# EasyEDA Pro project test Project_2026-04-05_21-01-09.eprj, board PCB1
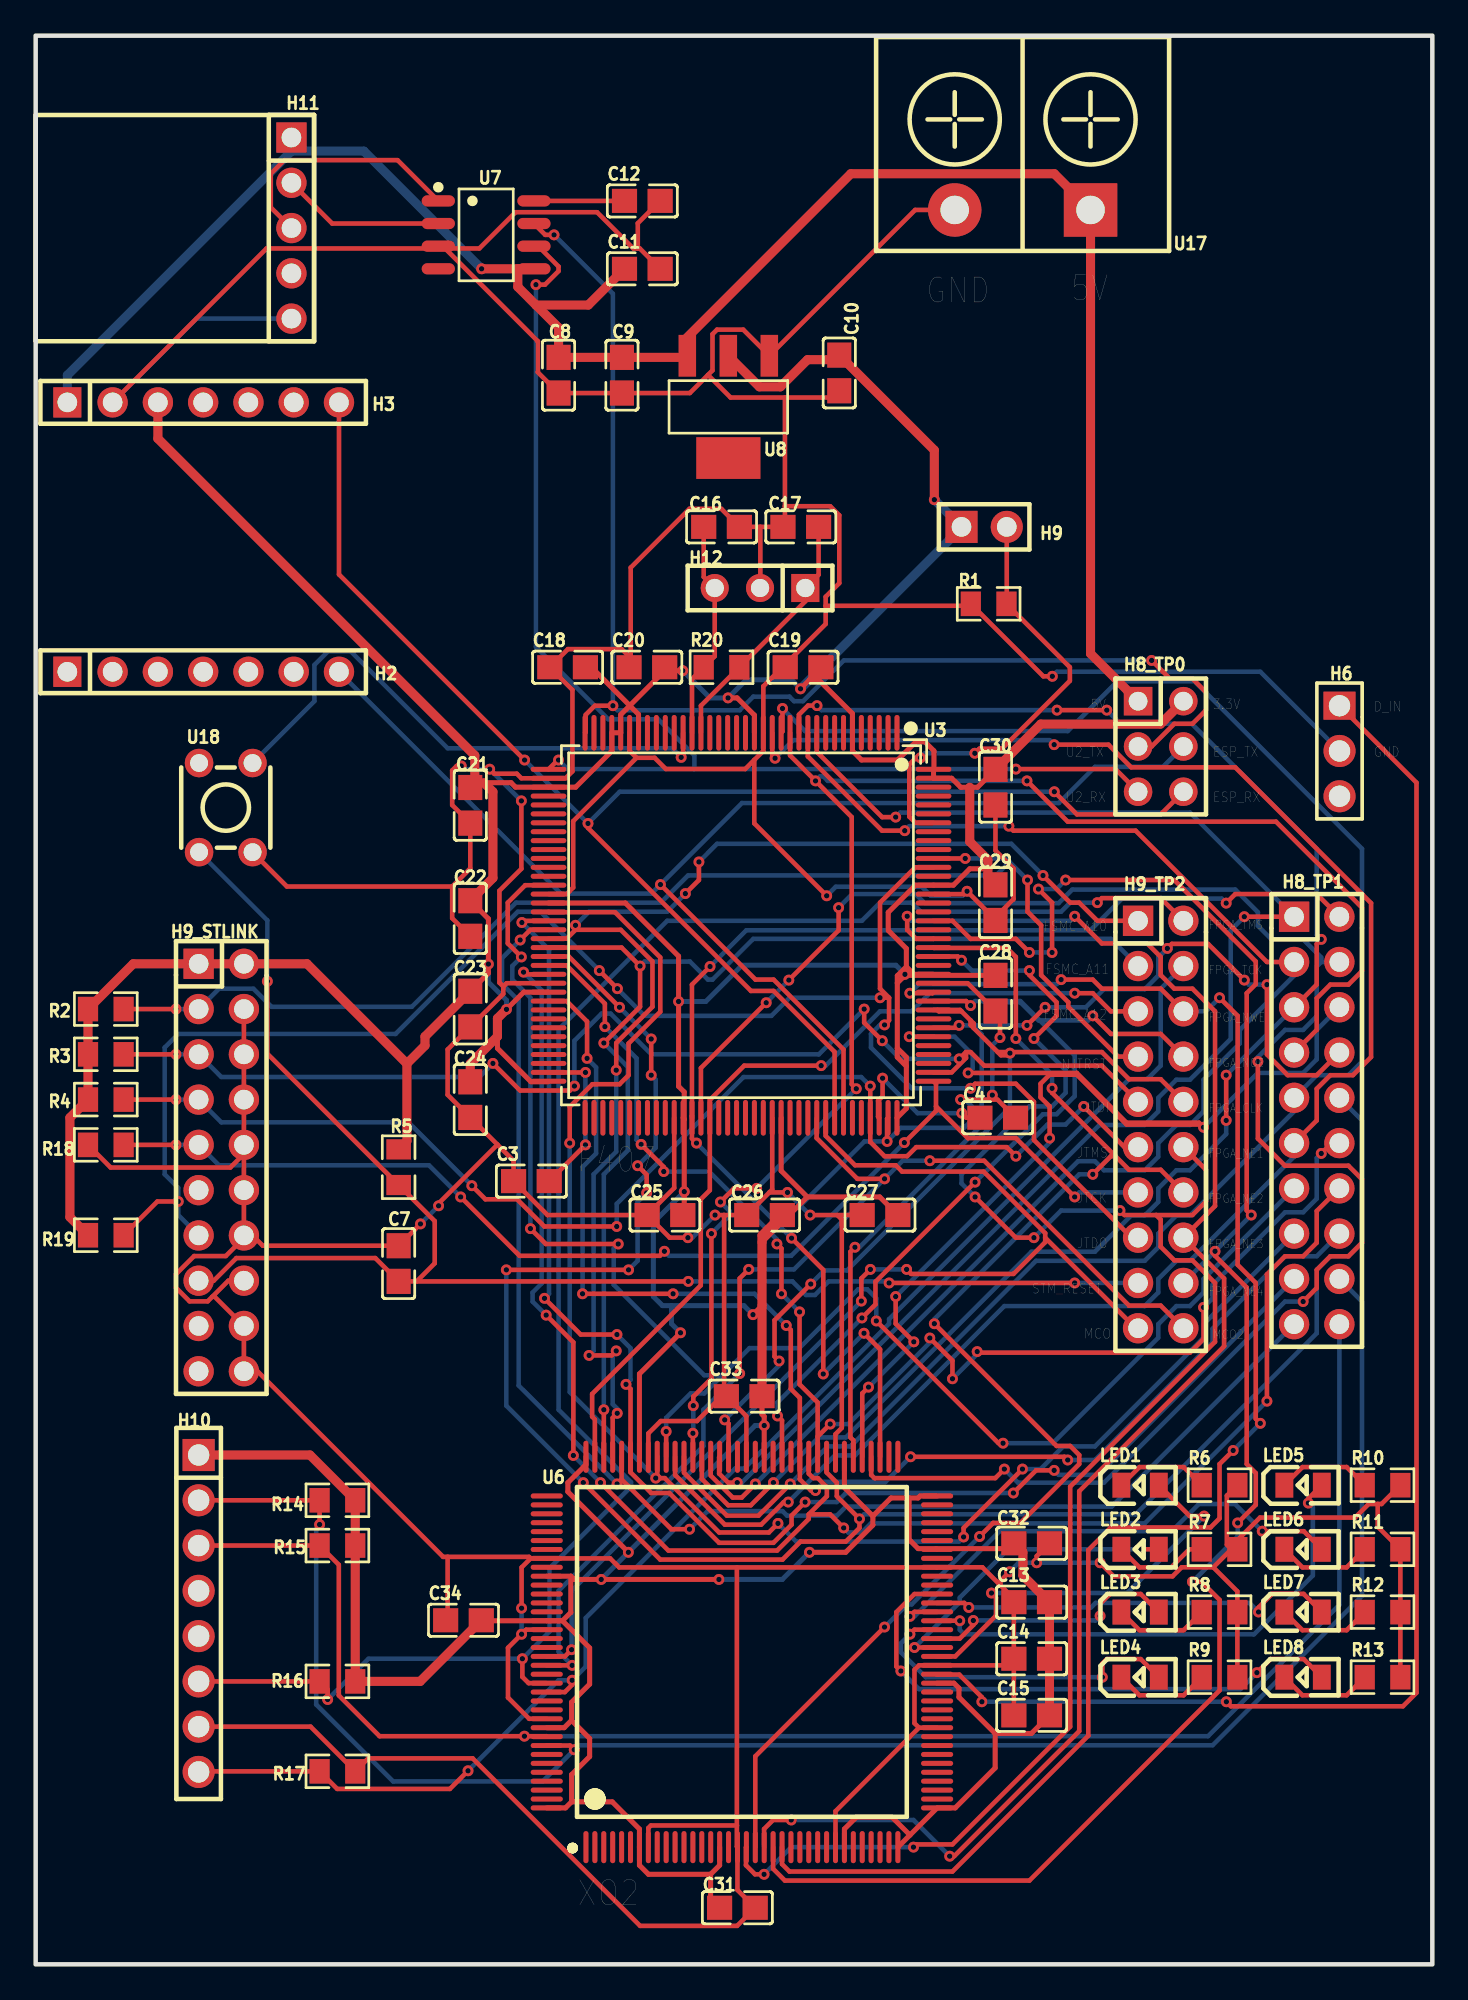
[diagram p1: board, top side]
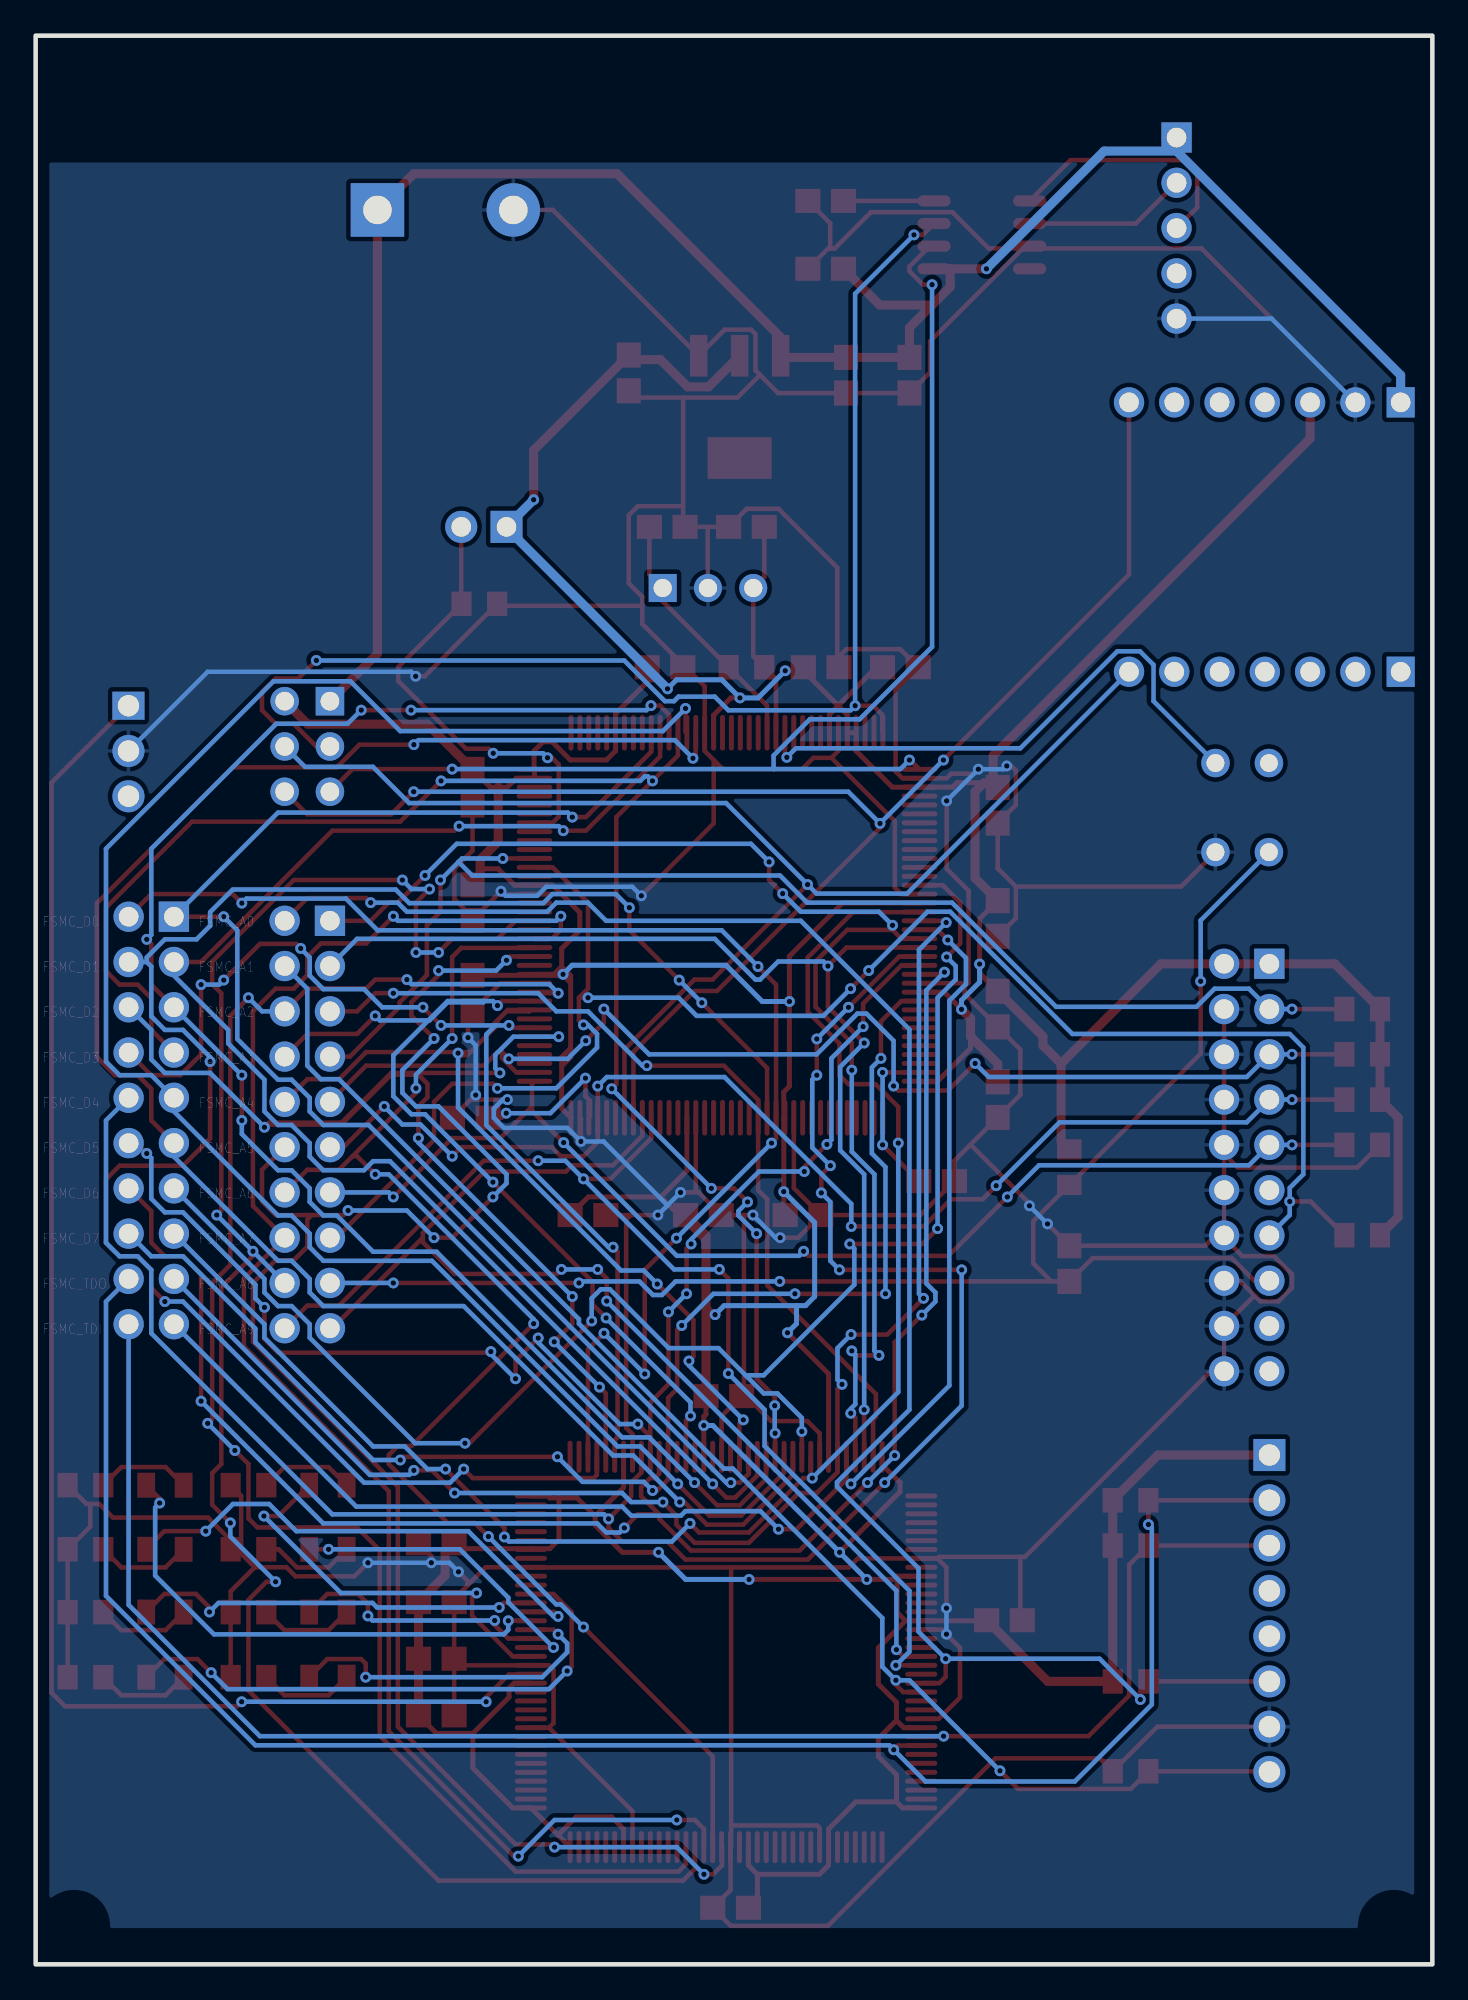
[diagram p2: board, bottom side, seen from below]

Outline 78.36 x 108.2 mm; copper layers: Top Layer, Bottom Layer. Coordinates in mm from the lower left corner of the outline.
Outline path: rectangle 0,108.2 78.36,0
Stack: Top Layer 0.035mm / Dielectric1 1.51mm FR4 er 4.5 / Bottom Layer 0.035mm

## Design rules (mm)
template: 自定义配置
spacing copperThickness1oz (default): track to track 0.102, other pairs 0.152 to 0.3
spacing copperThickness2oz: track to track 0.203, other pairs 0.152 to 0.3
track width copperThickness1oz (default): min 0.127, default 0.254, max 2.54
track width copperThickness2oz: min 0.203, default 0.508, max 2.54
differential pair differentialPair (default): width min 0.127, default 0.254, max 2.54; gap min 0.152, default 0.152
via viaSize (default): diameter min 0.5, default 0.61, max 10; hole min 0.3, default 0.305, max 6.3
net VCC_USB uses copperThickness2oz
net 3.3V uses copperThickness2oz

## Placement (name value [footprint] x y rotation side)
C3  2.2uF  [C0805]  27.81 43.94 0 top
C4  2.2uF  [C0805]  53.97 47.5 180 top
C7  10uF  [C0805]  20.37 39.32 90 top
C8  1uF  [C0805]  29.34 89.15 270 top
C9  100nF  [C0805]  32.89 89.15 270 top
C10  10uF  [C0805]  45.09 89.28 270 top
C11  0.1uF  [C0805]  34.04 95.12 0 top
C12  0.1uF  [C0805]  34.04 98.93 0 top
C13  0.1uF  [C0805]  55.88 20.32 0 top
C14  0.1uF  [C0805]  55.88 17.14 0 top
C15  0.1uF  [C0805]  55.88 13.97 0 top
C16  22pF  [C0805]  38.48 80.64 0 top
C17  22pF  [C0805]  42.93 80.64 180 top
C18  0.1uF  [C0805]  29.84 72.77 0 top
C19  0.1uF  [C0805]  43.05 72.77 0 top
C20  0.1uF  [C0805]  34.29 72.77 0 top
C21  0.1uF  [C0805]  24.38 65.02 90 top
C22  0.1uF  [C0805]  24.38 58.67 90 top
C23  0.1uF  [C0805]  24.38 53.59 90 top
C24  0.1uF  [C0805]  24.38 48.51 90 top
C25  0.1uF  [C0805]  35.31 42.04 0 top
C26  0.1uF  [C0805]  40.89 42.04 0 top
C27  0.1uF  [C0805]  47.37 42.04 0 top
C28  0.1uF  [C0805]  53.85 54.48 90 top
C29  0.1uF  [C0805]  53.85 59.56 90 top
C30  0.1uF  [C0805]  53.85 66.04 90 top
C31  0.1uF  [C0805]  39.37 3.17 180 top
C32  0.1uF  [C0805]  55.88 23.62 180 top
C33  0.1uF  [C0805]  39.75 31.88 0 top
C34  0.1uF  [C0805]  24 19.3 0 top
H2  PM254V-11-07-H85  [HDR-TH_7P-P2.54-V-F]  9.4 72.52 0 top
H3  PM254V-11-07-H85  [HDR-TH_7P-P2.54-V-F]  9.4 87.63 0 top
H6  2.54-1*3P针_forLED  [HDR-TH_3P-P2.54-V-M-1]  73.15 68.07 270 top
H8_TP0  -  [HDR-TH_6P-P2.54-V-R2-C3-S2.54_A2541WV-2X3P]  63.12 68.33 270 top
H8_TP1  -  [HDR-TH_20P-P2.54-V-M-R2-C10-S2.54]  71.87 47.34 270 top
H9  -  [HDR-TH_2P-P2.54-V-M-1]  53.21 80.64 0 top
H9_STLINK  -  [HDR-TH_20P-P2.54-V-M-R2-C10-S2.54]  10.41 44.7 270 top
H9_TP2  -  [HDR-TH_20P-P2.54-V-M-R2-C10-S2.54]  63.12 47.12 270 top
H10  -  [HDR-TH_8P-P2.54-V-F-1]  9.14 19.69 270 top
H11  -  [HDR-TH_5P-P2.54-V-M]  14.35 97.41 270 top
H12  -  [HDR-TH_3P-P2.54-V-F]  40.64 77.22 180 top
LED1  -  [LED0805-R-RD]  61.96 26.88 0 top
LED2  -  [LED0805-R-RD]  61.96 23.29 0 top
LED3  -  [LED0805-R-RD]  61.96 19.76 0 top
LED4  -  [LED0805-R-RD]  61.96 16.11 0 top
LED5  -  [LED0805-R-RD]  71.11 26.88 0 top
LED6  -  [LED0805-R-RD]  71.11 23.29 0 top
LED7  -  [LED0805-R-RD]  71.11 19.76 0 top
LED8  -  [LED0805-R-RD]  71.11 16.11 0 top
R1  10K  [R0805]  53.47 76.33 180 top
R2  10K  [R0805]  3.94 53.59 0 top
R3  10K  [R0805]  3.94 51.05 0 top
R4  10K  [R0805]  3.94 48.51 0 top
R5  10K  [R0805]  20.37 44.72 90 top
R6  1K  [R0805]  66.42 26.88 0 top
R7  1K  [R0805]  66.42 23.29 0 top
R8  1K  [R0805]  66.42 19.76 0 top
R9  1K  [R0805]  66.42 16.11 0 top
R10  1K  [R0805]  75.56 26.88 0 top
R11  1K  [R0805]  75.56 23.29 0 top
R12  1K  [R0805]  75.56 19.76 0 top
R13  1K  [R0805]  75.56 16.11 0 top
R14  5K  [R0805]  16.93 26.03 0 top
R15  5K  [R0805]  16.93 23.49 0 top
R16  5K  [R0805]  16.93 15.88 0 top
R17  2K  [R0805]  16.93 10.83 0 top
R18  10K  [R0805]  3.94 45.97 0 top
R19  10K  [R0805]  3.94 40.91 0 top
R20  10M  [R0805]  38.48 72.77 0 top
U3  STM32F407ZGT6  [LQFP-144_L20.0-W20.0-P0.50-LS22.0-BL]  39.57 58.29 180 top
U6  LCMXO2-4000HC-4TG144C  [TQFP-144_L20.0-W20.0-P0.50-LS22.0-BL]  39.62 17.53 0 top
U7  CH330N  [SOP-8_L4.9-W3.9-P1.27-LS6.0-BL]  25.27 97.03 270 top
U8  AMS1117-3.3  [SOT-223-3_L6.7-W3.7-P2.30-LS7.0-BR]  38.86 87.38 90 top
U17  KF7.62-2P  [CONN-TH_KF7.62-2P]  55.37 98.42 180 top
U18  HX TS4540CJ 160gf 022  [KEY-TH_4P-L4.5-W4.5-P3.00-LS5.0-TL]  10.67 64.9 90 top

## Footprints (pads in the part's own frame, mm; a bottom-side part is the same pattern mirrored in y, then rotated)
C0805
  rect 1.41x1.35 smd: 1(-1,0) 2(1,0)
CONN-TH_KF7.62-2P
  rect 3x3 hole 1.6: 1(-3.81,0)
  round 3 hole 1.6: 2(3.81,0)
HDR-TH_2P-P2.54-V-M-1
  rect 1.8x1.8 hole 1.1: 1(-1.27,0)
  round 1.8 hole 1.1: 2(1.27,0)
HDR-TH_3P-P2.54-V-F
  rect 1.575x1.575 hole 1.02: 1(-2.54,0)
  round 1.575 hole 1.02: 2(0,0) 3(2.54,0)
HDR-TH_3P-P2.54-V-M-1
  rect 1.575x1.8 hole 1.2: 1(-2.54,0)
  round 1.8 hole 1.2: 2(0,0) 3(2.54,0)
HDR-TH_5P-P2.54-V-M
  rect 1.7x1.7 hole 1.1: 1(-5.08,0)
  round 1.7 hole 1.1: 2(-2.54,0) 3(0,0) 4(2.54,0) 5(5.08,0)
HDR-TH_6P-P2.54-V-R2-C3-S2.54_A2541WV-2X3P
  rect 1.6x1.6 hole 1.05: 1(-2.54,-1.27)
  round 1.6 hole 1.05: 2(-2.54,1.27) 3(0,-1.27) 4(0,1.27) 5(2.54,-1.27) 6(2.54,1.27)
HDR-TH_7P-P2.54-V-F
  rect 1.575x1.7 hole 1.1: 1(-7.62,0)
  round 1.7 hole 1.1: 2(-5.08,0) 3(-2.54,0) 4(0,0) 5(2.54,0) 6(5.08,0) 7(7.62,0)
HDR-TH_8P-P2.54-V-F-1
  rect 1.8x1.8 hole 1.2: 1(-8.89,0)
  round 1.8 hole 1.2: 2(-6.35,0) 3(-3.81,0) 4(-1.27,0) 5(1.27,0) 6(3.81,0) 7(6.35,0) 8(8.89,0)
HDR-TH_20P-P2.54-V-M-R2-C10-S2.54
  rect 1.7x1.7 hole 1.1: 1(-11.43,-1.27)
  round 1.7 hole 1.1: 2(-11.43,1.27) 3(-8.89,-1.27) 4(-8.89,1.27) 5(-6.35,-1.27) 6(-6.35,1.27) 7(-3.81,-1.27) 8(-3.81,1.27) 9(-1.27,-1.27) 10(-1.27,1.27) 11(1.27,-1.27) 12(1.27,1.27) 13(3.81,-1.27) 14(3.81,1.27) 15(6.35,-1.27) 16(6.35,1.27) 17(8.89,-1.27) 18(8.89,1.27) 19(11.43,-1.27) 20(11.43,1.27)
KEY-TH_4P-L4.5-W4.5-P3.00-LS5.0-TL
  round 1.6 hole 1: 1(-2.5,1.5) 2(2.5,1.5) 3(-2.5,-1.5) 4(2.5,-1.5)
LED0805-R-RD
  rect 1x1.399 smd: 1(1.05,0) 2(-1.05,0)
LQFP-144_L20.0-W20.0-P0.50-LS22.0-BL
  oval 0.28x2 smd: 1(-8.75,-10.8) 2(-8.25,-10.8) 3(-7.75,-10.8) 4(-7.25,-10.8) 5(-6.75,-10.8) 6(-6.25,-10.8) 7(-5.75,-10.8) 8(-5.25,-10.8) 9(-4.75,-10.8) 10(-4.25,-10.8) 11(-3.75,-10.8) 12(-3.25,-10.8) 13(-2.75,-10.8) 14(-2.25,-10.8) 15(-1.75,-10.8) 16(-1.25,-10.8) 17(-0.75,-10.8) 18(-0.25,-10.8) 19(0.25,-10.8) 20(0.75,-10.8) 21(1.25,-10.8) 22(1.75,-10.8) 23(2.25,-10.8) 24(2.75,-10.8) 25(3.25,-10.8) 26(3.75,-10.8) 27(4.25,-10.8) 28(4.75,-10.8) 29(5.25,-10.8) 30(5.75,-10.8) 31(6.25,-10.8) 32(6.75,-10.8) 33(7.25,-10.8) 34(7.75,-10.8) 35(8.25,-10.8) 36(8.75,-10.8) 73(8.75,10.8) 74(8.25,10.8) 75(7.75,10.8) 76(7.25,10.8) 77(6.75,10.8) 78(6.25,10.8) 79(5.75,10.8) 80(5.25,10.8) 81(4.75,10.8) 82(4.25,10.8) 83(3.75,10.8) 84(3.25,10.8) 85(2.75,10.8) 86(2.25,10.8) 87(1.75,10.8) 88(1.25,10.8) 89(0.75,10.8) 90(0.25,10.8) 91(-0.25,10.8) 92(-0.75,10.8) 93(-1.25,10.8) 94(-1.75,10.8) 95(-2.25,10.8) 96(-2.75,10.8) 97(-3.25,10.8) 98(-3.75,10.8) 99(-4.25,10.8) 100(-4.75,10.8) 101(-5.25,10.8) 102(-5.75,10.8) 103(-6.25,10.8) 104(-6.75,10.8) 105(-7.25,10.8) 106(-7.75,10.8) 107(-8.25,10.8) 108(-8.75,10.8)
  oval 2x0.28 smd: 37(10.8,-8.75) 38(10.8,-8.25) 39(10.8,-7.75) 40(10.8,-7.25) 41(10.8,-6.75) 42(10.8,-6.25) 43(10.8,-5.75) 44(10.8,-5.25) 45(10.8,-4.75) 46(10.8,-4.25) 47(10.8,-3.75) 48(10.8,-3.25) 49(10.8,-2.75) 50(10.8,-2.25) 51(10.8,-1.75) 52(10.8,-1.25) 53(10.8,-0.75) 54(10.8,-0.25) 55(10.8,0.25) 56(10.8,0.75) 57(10.8,1.25) 58(10.8,1.75) 59(10.8,2.25) 60(10.8,2.75) 61(10.8,3.25) 62(10.8,3.75) 63(10.8,4.25) 64(10.8,4.75) 65(10.8,5.25) 66(10.8,5.75) 67(10.8,6.25) 68(10.8,6.75) 69(10.8,7.25) 70(10.8,7.75) 71(10.8,8.25) 72(10.8,8.75) 109(-10.8,8.75) 110(-10.8,8.25) 111(-10.8,7.75) 112(-10.8,7.25) 113(-10.8,6.75) 114(-10.8,6.25) 115(-10.8,5.75) 116(-10.8,5.25) 117(-10.8,4.75) 118(-10.8,4.25) 119(-10.8,3.75) 120(-10.8,3.25) 121(-10.8,2.75) 122(-10.8,2.25) 123(-10.8,1.75) 124(-10.8,1.25) 125(-10.8,0.75) 126(-10.8,0.25) 127(-10.8,-0.25) 128(-10.8,-0.75) 129(-10.8,-1.25) 130(-10.8,-1.75) 131(-10.8,-2.25) 132(-10.8,-2.75) 133(-10.8,-3.25) 134(-10.8,-3.75) 135(-10.8,-4.25) 136(-10.8,-4.75) 137(-10.8,-5.25) 138(-10.8,-5.75) 139(-10.8,-6.25) 140(-10.8,-6.75) 141(-10.8,-7.25) 142(-10.8,-7.75) 143(-10.8,-8.25) 144(-10.8,-8.75)
R0805
  rect 1.133x1.377 smd: 1(-1,0) 2(1,0)
SOP-8_L4.9-W3.9-P1.27-LS6.0-BL
  oval 0.63x1.865 smd: 1(-1.905,-2.683) 2(-0.635,-2.683) 3(0.635,-2.683) 4(1.905,-2.683) 5(1.905,2.683) 6(0.635,2.683) 7(-0.635,2.683) 8(-1.905,2.683)
SOT-223-3_L6.7-W3.7-P2.30-LS7.0-BR
  rect 2.34x0.98 smd: 1(2.87,-2.3) 2(2.87,0) 3(2.87,2.3)
  rect 2.34x3.6 smd: 4(-2.87,0)
TQFP-144_L20.0-W20.0-P0.50-LS22.0-BL
  oval 0.28x1.8 smd: 1(-8.75,-10.95) 2(-8.25,-10.95) 3(-7.75,-10.95) 4(-7.25,-10.95) 5(-6.75,-10.95) 6(-6.25,-10.95) 7(-5.75,-10.95) 8(-5.25,-10.95) 9(-4.75,-10.95) 10(-4.25,-10.95) 11(-3.75,-10.95) 12(-3.25,-10.95) 13(-2.75,-10.95) 14(-2.25,-10.95) 15(-1.75,-10.95) 16(-1.25,-10.95) 17(-0.75,-10.95) 18(-0.25,-10.95) 19(0.25,-10.95) 20(0.75,-10.95) 21(1.25,-10.95) 22(1.75,-10.95) 23(2.25,-10.95) 24(2.75,-10.95) 25(3.25,-10.95) 26(3.75,-10.95) 27(4.25,-10.95) 28(4.75,-10.95) 29(5.25,-10.95) 30(5.75,-10.95) 31(6.25,-10.95) 32(6.75,-10.95) 33(7.25,-10.95) 34(7.75,-10.95) 35(8.25,-10.95) 36(8.75,-10.95) 73(8.75,10.95) 74(8.25,10.95) 75(7.75,10.95) 76(7.25,10.95) 77(6.75,10.95) 78(6.25,10.95) 79(5.75,10.95) 80(5.25,10.95) 81(4.75,10.95) 82(4.25,10.95) 83(3.75,10.95) 84(3.25,10.95) 85(2.75,10.95) 86(2.25,10.95) 87(1.75,10.95) 88(1.25,10.95) 89(0.75,10.95) 90(0.25,10.95) 91(-0.25,10.95) 92(-0.75,10.95) 93(-1.25,10.95) 94(-1.75,10.95) 95(-2.25,10.95) 96(-2.75,10.95) 97(-3.25,10.95) 98(-3.75,10.95) 99(-4.25,10.95) 100(-4.75,10.95) 101(-5.25,10.95) 102(-5.75,10.95) 103(-6.25,10.95) 104(-6.75,10.95) 105(-7.25,10.95) 106(-7.75,10.95) 107(-8.25,10.95) 108(-8.75,10.95)
  oval 1.8x0.28 smd: 37(10.95,-8.75) 38(10.95,-8.25) 39(10.95,-7.75) 40(10.95,-7.25) 41(10.95,-6.75) 42(10.95,-6.25) 43(10.95,-5.75) 44(10.95,-5.25) 45(10.95,-4.75) 46(10.95,-4.25) 47(10.95,-3.75) 48(10.95,-3.25) 49(10.95,-2.75) 50(10.95,-2.25) 51(10.95,-1.75) 52(10.95,-1.25) 53(10.95,-0.75) 54(10.95,-0.25) 55(10.95,0.25) 56(10.95,0.75) 57(10.95,1.25) 58(10.95,1.75) 59(10.95,2.25) 60(10.95,2.75) 61(10.95,3.25) 62(10.95,3.75) 63(10.95,4.25) 64(10.95,4.75) 65(10.95,5.25) 66(10.95,5.75) 67(10.95,6.25) 68(10.95,6.75) 69(10.95,7.25) 70(10.95,7.75) 71(10.95,8.25) 72(10.95,8.75) 109(-10.95,8.75) 110(-10.95,8.25) 111(-10.95,7.75) 112(-10.95,7.25) 113(-10.95,6.75) 114(-10.95,6.25) 115(-10.95,5.75) 116(-10.95,5.25) 117(-10.95,4.75) 118(-10.95,4.25) 119(-10.95,3.75) 120(-10.95,3.25) 121(-10.95,2.75) 122(-10.95,2.25) 123(-10.95,1.75) 124(-10.95,1.25) 125(-10.95,0.75) 126(-10.95,0.25) 127(-10.95,-0.25) 128(-10.95,-0.75) 129(-10.95,-1.25) 130(-10.95,-1.75) 131(-10.95,-2.25) 132(-10.95,-2.75) 133(-10.95,-3.25) 134(-10.95,-3.75) 135(-10.95,-4.25) 136(-10.95,-4.75) 137(-10.95,-5.25) 138(-10.95,-5.75) 139(-10.95,-6.25) 140(-10.95,-6.75) 141(-10.95,-7.25) 142(-10.95,-7.75) 143(-10.95,-8.25) 144(-10.95,-8.75)

## Nets
As in the schematic.

Pads without a net: H2 1 2 3 4 5 6; H3 4 5 6; H6 3; H9_STLINK 11 17 19; H10 4 5; H11 4; U3 1 2 3 4 5 7 8 9 18 19 20 21 22 26 27 28 29 34 35 40 41 42 43 44 45 46 47 48 49 64 65 66 67 68 69 70 73 74 75 76 77 78 79 80 81 82 88 89 90 91 92 93 96 97 98 103 104 111 112 113 116 122 126 128 129 132 135 136 137 139 140 141 142; U6 1 2 3 4 5 6 9 10 11 12 13 14 15 17 24 25 26 27 28 31 32 33 34 35 38 39 40 41 42 43 44 45 47 48 49 50 62 63 65 67 68 69 70 71 73 74 85 87 89 91 109 110 111 112 113 114 115 117 119 120 121 122 125 126 129 132 133 138 139 140 141 142 143; U7 4; U8 4; U18 2

## Via types
v1: diameter 0.61, hole 0.305, Top Layer to Bottom Layer, 280 vias

## Routing (per net, layer and track width the routed paths; a pad name or vN(x,y) marks a point on that pad's centre or on a via; arc(x,y) is an arc through that point)
3.3V: length 476.1
  Top Layer w0.28: 48.85,55.97 48.85,56.99 47.83,58 47.83,59.02 49.36,60.54 U3.131 51.49,60.54 52.41,61.46 53.42,61.46 ; 48.85,55.97 49.28,55.54 ; 48.85,55.97 48.34,55.46 48.34,55.06 ; v1(38.85,71.05) 39.35,71.05 40.32,70.08 U3.17 ; 49,26.17 49.51,26.17 49.62,26.28 U6.72 ; 49,26.17 49,23.83 49.51,23.32 50.53,23.32 ; 49,26.17 47.99,26.17 46.97,25.15 ; 35.29,72.57 v1(36.31,72.57) ; 35.29,72.57 33.33,70.62 ; 35.29,72.57 C20.2 ; 30.02,21.78 30.02,19.74 29.56,19.28 ; 30.02,21.78 U6.118 ; 30.02,21.78 30.21,21.59 v1(31.73,21.59) v1(38.33,21.59) ; U6.135 29.65,13.28 30.06,13.69 ; 48.85,50.38 48.34,50.89 48.34,51.4 ; 48.85,50.38 48.85,50.89 48.34,51.4 ; 48.85,50.38 48.85,48.02 U3.108 ; v1(36.18,35.43) 33.87,33.13 U6.102 ; v1(43.41,23.12) 45.45,23.12 46.97,24.64 46.97,25.15 ; 43.29,43.05 47.35,43.05 C27.2 ; 43.29,43.05 40.75,40.51 ; 43.29,43.05 41.82,44.52 U3.95 ; 28.77,59.54 33.09,59.54 36.07,56.56 v1(36.07,54.02) 36.07,49.26 36.39,48.94 36.39,47.41 ; 46.97,25.15 45.37,26.75 U6.79 ; 48.34,55.06 48.77,55.48 C28.2 ; 48.34,55.06 48.34,51.4 ; U6.108 30.87,28.04 29.86,27.02 29.86,26.51 v1(33.25,23.12) ; C25.2 36.39,42.12 v1(36.39,43.35) 36.39,47.41 ; 49.05,7.25 U6.37 51.59,8.78 53.83,11.02 53.83,12.95 ; 49.05,7.25 U6.36 ; 49.05,7.25 48.03,8.27 46.05,8.27 45.37,7.59 U6.30 ; 33.33,70.62 32.82,70.11 U3.32 U3.33 32.33,68.07 30.3,66.04 26.92,66.04 26.67,66.29 24.64,66.29 ; 33.33,70.62 31.18,72.77 C18.2 ; 33.33,70.62 33.82,70.12 U3.30 ; 36.39,47.41 U3.84 ; C19.2 44.05,72.7 43.42,72.07 ; 49.28,55.54 U3.121 ; 49.28,55.54 v1(48.77,55.54) ; 50.53,23.32 54.58,23.32 C32.2 ; 50.53,23.32 U6.66 ; 43.42,72.07 v1(42.91,71.56) ; 43.42,72.07 43.93,72.07 45.82,70.17 U3.6 45.82,68.08 46.33,67.57 48.36,67.57 49.38,68.58 49.89,68.58 50.4,68.08 50.4,67.06 U3.144 U3.143 51.39,66.54 51.9,66.03 52.84,66.03 C30.2 ; C22.2 25.4,58.66 v1(25.4,56.12) 25.4,55.61 C23.2 ; 29.56,19.28 31.08,17.75 31.08,15.72 30.06,14.7 30.06,13.69 ; 29.56,19.28 U6.123 25.03,19.28 C34.2 ; 53.83,12.95 51.8,14.99 51.8,15.49 51.52,15.78 U6.51 ; 53.83,12.95 55.86,12.95 C15.2 ; 30.06,9.12 29.72,8.78 U6.144 ; 30.06,9.12 30.06,10.64 31.08,11.66 31.08,12.67 30.06,13.69 ; 30.06,9.12 32.35,9.12 33.87,7.59 U6.7 33.87,5.56 34.38,5.05 37.87,5.05 ; 28.77,54.54 27.38,54.54 v1(26.42,53.58) ; 37.87,5.05 37.87,3.68 C31.2 ; 37.87,5.05 38.37,5.56 U6.16 ; U6.88 v1(40.87,30.23) 40.87,30.74 40.75,30.86 C33.2 ; 28.77,49.54 28.75,49.51 27.79,49.51 25.91,51.39 25.91,52.05 ; v1(40.24,36.45) 40.75,36.96
  Top Layer w0.508: 20.83,50.53 15.22,56.13 H9_STLINK.2 5.48,56.13 R2.1 R3.1 R4.1 1.92,47.5 1.92,41.92 R19.1 ; 20.83,50.53 20.83,46.19 R5.2 ; 20.83,50.53 21.84,51.55 21.84,52.05 C23.2 ; 45.34,90.03 43.31,90.03 41.78,88.5 40.6,88.5 U8.2 ; 45.34,90.03 50.42,84.95 v1(50.42,82.17) ; 45.34,90.03 C10.1 ; 42.28,42.04 C26.2 40.75,40.89 C33.2 ; C21.2 24.64,66.29 24.64,67.82 6.86,85.6 H3.3 ; C34.2 21.57,15.88 R16.2 R15.2 R14.2 15.39,28.57 H10.1 ; H8_TP0.2 63.1,69.58 56.39,69.58 C30.2 ; v1(26.42,53.58) 25.91,53.07 25.91,52.05 24.38,50.53 C24.2 ; C22.2 25.65,60.94 25.65,65.79 25.15,66.29 ; 52.41,66.03 52.41,62.99 53.42,61.97 53.42,60.99 C29.2 ; C32.2 55.39,23.11 55.39,21.81 C13.2 C14.2 C15.2
  Bottom Layer w0.28: v1(25.4,56.12) 25.4,55.1 26.42,54.09 v1(26.42,53.58) ; v1(36.39,43.35) 34.66,41.62 34.66,37.46 35.16,36.96 35.67,36.96 ; v1(40.24,36.45) 39.73,36.96 35.67,36.96 ; 35.67,36.96 35.67,35.94 v1(36.18,35.43) ; v1(36.07,54.02) 37.59,54.02 39.63,56.05 48.26,56.05 v1(48.77,55.54) ; v1(38.33,21.59) 41.89,21.59 v1(43.41,23.12) ; v1(36.31,72.57) 37.83,71.05 v1(38.85,71.05) 39.86,72.07 42.4,72.07 v1(42.91,71.56) ; v1(31.73,21.59) v1(33.25,23.12) 40.37,30.23 v1(40.87,30.23)
  Bottom Layer w0.508: v1(42.91,71.56) 51.94,80.59 H9.1 v1(50.42,82.17)
GND: length 647.1
  Top Layer w0.254: 33.71,67.69 34.73,67.69 35.36,67.06 39.81,67.06 40.32,67.57 ; 33.71,67.69 33.32,68.08 U3.31 ; 33.71,67.69 30.16,64.13 30.16,60.41 29.79,60.04 28.77,60.04 ; 9.91,37.45 9.65,37.2 8.64,37.2 7.87,37.96 7.87,38.72 8.89,39.74 10.67,39.74 11.75,40.82 ; 9.91,37.45 10.05,37.45 H9_STLINK.18 H9_STLINK.20 12.45,33.27 22.86,22.86 23.11,22.86 ; 9.91,37.45 10.81,38.35 H9_STLINK.16 ; 9.14,13.33 15.42,13.33 R17.2 18.66,11.56 24.51,11.56 33.91,2.16 39.35,2.16 C31.1 39.37,4.17 U6.18 39.34,6.61 39.34,7.79 ; v1(47.77,46.17) 47.77,47.44 U3.107 ; 25.91,45.99 26.81,45.08 C3.1 28.72,42.04 C25.1 ; 25.91,45.99 22.61,42.69 v1(22.61,42.56) ; 25.91,45.99 C24.1 23.11,48.78 23.11,51.32 C23.1 26.23,54.44 26.23,54.86 ; 23.11,22.86 23.11,19.41 C34.1 ; 23.11,22.86 27.69,22.86 27.77,22.78 ; 53.67,48.51 53.96,48.51 C4.1 ; 53.67,48.51 v1(51.89,48.51) ; 53.67,48.51 v1(53.67,48.77) ; 54.13,21.26 53.11,22.28 U6.64 50.57,22.27 39.34,22.27 ; 54.13,21.26 54.13,21.51 v1(54.64,22.02) ; 54.13,21.26 54.88,20.51 C13.1 C14.1 54.88,16.89 ; 39.34,22.27 39.34,7.79 ; 39.34,22.27 32.74,22.27 32.23,22.78 U6.116 27.77,22.78 ; 39.34,7.79 34.52,7.79 34.37,7.65 U6.8 ; H9_STLINK.4 H9_STLINK.6 H9_STLINK.8 H9_STLINK.10 11.68,45.47 ; 37.72,89.17 38.99,87.9 42.04,87.9 ; 37.72,89.17 37.97,89.42 37.97,91.46 38.23,91.71 39.7,91.71 U8.1 49.34,98.42 U17.2 ; 37.72,89.17 36.7,88.15 C9.2 C8.2 28.18,89.31 28.18,91.06 22.97,96.27 ; 22.46,96.27 U7.3 22.84,96.39 22.97,96.27 ; 22.46,96.27 12.95,96.27 H3.2 ; 22.46,96.27 22.97,96.27 ; 11.68,45.47 H9_STLINK.12 H9_STLINK.14 11.75,40.82 ; 11.68,45.47 10.92,44.7 4.21,44.7 R18.1 ; 40.32,67.57 40.82,68.08 U3.16 40.82,71.7 42.04,72.91 ; 40.32,67.57 40.32,64.01 v1(44.38,59.95) ; 42.04,81.8 44.58,81.8 45.09,81.3 45.09,77.49 44.32,76.72 44.32,76.22 ; 42.04,81.8 42.04,87.9 ; 42.04,81.8 42.04,80.76 C17.2 40.66,80.64 ; 54.88,16.89 54.76,16.78 U6.53 49.56,16.78 49.3,16.52 49.3,13.53 49.56,13.28 ; 54.88,16.89 C15.1 ; U3.120 52.29,55.04 C28.1 54.1,53.23 v1(54.1,51.99) ; U3.94 41.32,43.47 41.16,43.31 ; 23.37,60.47 14.1,60.47 U18.3 ; 23.37,60.47 24.38,61.48 C21.1 23.37,65.04 23.37,66.98 23.62,67.23 v1(23.88,67.23) ; 23.37,60.47 23.37,58.69 C22.1 ; 42.04,87.9 44.7,87.9 C10.2 ; 27.77,22.78 27.26,22.27 v1(27.26,19.98) ; C20.1 33.38,72.87 33.38,73.28 ; 75.29,25.83 74.78,25.83 74.02,25.06 68.69,25.06 67.42,23.79 R7.2 ; 75.29,25.83 75.51,25.83 R10.2 ; 75.29,25.83 75.29,24.56 R11.2 R12.2 R13.2 ; U6.90 39.87,30.75 C33.1 38.62,32 ; C32.1 56.16,22.9 v1(56.16,22.53) ; 41.16,43.31 v1(42.18,43.31) ; 41.16,43.31 C26.1 38.62,42.04 ; 22.97,96.27 24.89,96.27 26.92,98.3 31.5,98.3 33.53,96.27 33.78,96.27 ; 53.78,58.68 C29.1 ; 53.78,58.68 54.86,59.76 54.86,61.47 53.85,62.49 C30.1 ; 53.78,58.68 v1(52.25,60.2) 52.09,60.04 U3.130 ; v1(27.25,65.27) 27.25,61.46 26.02,60.23 26.02,55.07 26.23,54.86 ; U6.134 27.69,13.78 26.5,14.97 26.5,17.76 v1(27.26,18.52) 27.52,18.78 U6.124 ; 26.23,54.86 26.42,55.04 28.77,55.04 ; 33.38,73.28 33.38,78.36 36.69,81.66 38.47,81.66 C16.2 40.66,80.64 ; 33.38,73.28 32.88,73.79 29.86,73.79 C18.1 30.12,71.5 30.12,66.93 29.73,66.54 27.25,66.54 27,66.8 25.73,66.8 v1(25.47,67.05) ; U6.29 44.87,8.59 49.56,13.28 ; 40.66,80.64 40.66,77.23 H12.2 ; 38.62,42.04 38.62,32 ; 38.62,42.04 v1(38.12,42.04) ; 38.62,32 37.1,30.48 35.07,30.48 34.37,29.79 U6.101 ; 42.04,72.91 44.32,75.2 44.32,76.22 ; 42.04,72.91 C19.1 ; 11.75,40.82 12.24,40.82 12.74,40.32 C7.2 v1(21.59,41.54) ; 49.56,13.28 U6.46 ; v1(36.59,40.77) 35.58,40.77 C25.1 ; 33.78,96.27 33.89,96.27 C11.2 ; 33.78,96.27 33.78,97.68 C12.2 ; C25.1 35.82,43.55 U3.83 ; 44.97,42.04 C27.1 ; 44.97,42.04 v1(43.45,42.04) ; 44.97,42.04 45.23,41.78 45.23,30.1 44.87,29.74 U6.80 ; 67.08,23.29 66.83,23.55 66.83,26.29 R6.2 ; 67.08,23.29 66.07,22.28 ; 67.08,23.29 67.41,23.29 ; 66.07,22.28 67.42,20.92 R8.2 R9.2 ; 66.07,22.28 64.29,22.28 63.78,21.77 60.48,21.77 v1(59.72,22.53) ; 44.32,76.22 52.36,76.22 R1.2 56.53,72.26 v1(57.04,72.26)
  Bottom Layer w0.254: H3.2 9.02,92.33 H11.5 ; v1(44.38,59.95) 44.89,60.46 49.71,60.46 50.22,59.95 52,59.95 v1(52.25,60.2) ; v1(38.12,42.04) 36.85,40.77 v1(36.59,40.77) ; v1(53.67,48.77) 53.67,51.56 v1(54.1,51.99) ; v1(59.72,22.53) v1(56.16,22.53) 55.15,22.53 v1(54.64,22.02) ; 42.94,42.54 v1(43.45,42.04) ; 42.94,42.54 v1(42.18,43.31) ; 42.94,42.54 42.94,42.61 46.5,46.17 v1(47.77,46.17) 48.53,46.93 52.09,46.93 52.66,47.5 52.66,48.01 52.15,48.51 v1(51.89,48.51) ; v1(57.04,72.26) 57.29,72.52 68.71,72.52 H6.2 ; v1(22.61,42.56) v1(21.59,41.54) ; v1(23.88,67.23) 24.06,67.05 v1(25.47,67.05) v1(27.25,65.27) ; v1(27.26,19.98) v1(27.26,18.52)
VCC_USB: length 112.5
  Top Layer w0.508: 28.07,93.09 27.05,94.11 27.05,95.12 ; 28.07,93.09 31,93.09 C11.1 ; 28.07,93.09 29.34,91.82 C8.1 C9.1 36.45,90.15 ; 36.45,90.15 36.45,91.17 45.74,100.46 57.15,100.46 U17.1 59.18,73.53 H8_TP0.1 ; 36.45,90.15 U8.3 ; v1(25.02,95.12) 27.05,95.12 ; 27.05,95.12 U7.5
  Bottom Layer w0.508: 14.35,101.73 18.41,101.73 v1(25.02,95.12) ; 14.35,101.73 1.78,89.15 H3.1 ; 14.35,101.73 H11.1
D_IN: length 85.3
  Top Layer w0.254: v1(53.09,14.73) 53.09,14.99 51.82,16.26 50.59,16.26 U6.52 ; H6.1 77.47,66.29 77.47,15.24 76.71,14.48 67.06,14.48 v1(66.8,14.73)
  Bottom Layer w0.254: v1(66.8,14.73) v1(53.09,14.73)
ESP_RX: length 87.6
  Top Layer w0.254: H3.7 17.02,77.98 v1(27.43,67.56) ; U3.101 44.82,51.19 41.4,54.61 40.13,54.61 30.99,63.75 v1(30.99,64.01) ; v1(57.15,65.79) 58.42,64.52 63.12,64.52 H8_TP0.6
  Bottom Layer w0.254: v1(57.15,65.79) 32.77,65.79 v1(30.99,64.01) v1(27.43,67.56)
ESP_TX: length 73.9
  Top Layer w0.254: U3.102 45.32,51.32 41.4,55.24 40.39,55.24 v1(35.05,60.58)
  Bottom Layer w0.254: H2.7 29.46,60.07 34.54,60.07 v1(35.05,60.58) 39.62,65.15 57.4,65.15 59.44,67.18 63.25,67.18 H8_TP0.4
FPGA_TCK: length 80.9
  Top Layer w0.254: v1(30.1,15.94) 30.1,15.69 29.69,15.28 U6.131 ; v1(24.26,10.86) 23.24,9.84 16.92,9.84 R17.1 9.18,10.83 9.14,10.79
  Bottom Layer w0.254: H9_TP2.4 63.12,54.74 63.12,50.42 62.36,49.66 61.34,49.66 47.88,36.19 47.88,35.94 39.75,27.81 39.24,27.81 30.86,19.43 30.86,16.7 v1(30.1,15.94) 29.34,15.94 v1(24.26,10.86)
FPGA_TDI: length 92.8
  Top Layer w0.254: U6.136 28.65,12.8 v1(27.42,12.8) 19.29,12.8 17.01,15.09 17.01,22.42 R15.1 9.14,23.49
  Bottom Layer w0.254: v1(27.42,12.8) 65.78,12.8 73.14,20.17 H8_TP1.20
FPGA_TDO: length 103
  Top Layer w0.254: H10.2 R14.1 v1(15.93,24.68) ; U6.137 29.98,12.28 v1(30.22,12.04)
  Bottom Layer w0.254: H8_TP1.18 74.41,37.18 74.41,20.67 66.03,12.29 30.47,12.29 v1(30.22,12.04) 28.44,10.26 20.06,10.26 15.74,14.58 15.74,24.48 v1(15.93,24.68)
FPGA_TMS: length 101
  Top Layer w0.254: 64.39,58.55 63.12,59.82 59.82,59.82 v1(59.56,59.56) ; v1(16.38,14.86) 16.38,15.42 R16.1 H10.6 ; v1(27.31,17.14) 27.31,16.13 27.66,15.78 U6.130
  Bottom Layer w0.254: v1(59.56,59.56) 58.04,59.56 57.53,59.05 49.66,59.05 49.15,59.56 47.37,59.56 46.35,58.55 35.43,58.55 29.34,52.45 29.34,31.11 33.4,27.05 33.4,26.8 28.83,22.22 28.83,18.67 v1(27.31,17.14) 18.67,17.14 v1(16.38,14.86)
FSMC_A0: length 82.5
  Top Layer w0.254: H8_TP1.1 v1(67.81,58.77) ; v1(48.25,64.36) 47.49,64.36 43.82,68.03 U3.10 ; U6.93 38.34,28.45 38.34,27.53 38.85,27.02 v1(39.36,27.02)
  Bottom Layer w0.254: H8_TP1.1 64.76,64.62 48.5,64.62 v1(48.25,64.36) ; v1(67.81,58.77) 67.05,58.01 67.05,51.92 64.76,49.63 64,49.63 62.98,48.61 62.98,47.85 62.22,47.09 59.68,47.09 39.61,27.02 v1(39.36,27.02)
FSMC_A1: length 83.1
  Top Layer w0.254: U6.94 37.87,27.42 39.11,26.19 39.61,26.19 v1(40.38,26.95) ; H8_TP1.3 69.08,56.23 61.71,63.6 54.85,63.6 v1(54.6,63.85) ; U3.11 43.32,67.76 47.49,63.6 v1(48.76,63.6)
  Bottom Layer w0.254: v1(40.38,26.95) 58.48,45.06 59.43,45.06 59.93,44.55 62.22,44.55 62.98,45.31 62.98,46.07 64,47.09 64.76,47.09 65.52,47.85 65.52,49.63 67.55,51.66 67.55,52.42 70.6,55.47 H8_TP1.3 ; v1(48.76,63.6) 49.01,63.85 v1(54.6,63.85)
FSMC_A2: length 92.3
  Top Layer w0.254: v1(43.84,70.62) 43.33,70.62 42.82,70.11 U3.12 ; v1(60.09,70.36) v1(57.3,70.36) ; v1(66.79,49.88) v1(66.79,47.34) ; v1(41.39,27.02) 40.12,25.75 38.85,25.75 37.37,27.23 U6.95 ; H8_TP1.5 71.87,54.96 71.87,57.25 v1(72.13,57.5)
  Bottom Layer w0.254: v1(43.84,70.62) 44.09,70.36 v1(57.3,70.36) ; v1(41.39,27.02) 43.93,29.56 45.46,29.56 55.87,39.98 59.43,39.98 61.46,42.01 62.22,42.01 62.98,42.77 62.98,43.53 64,44.55 64.76,44.55 66.79,46.58 v1(66.79,47.34) ; v1(60.09,70.36) 60.86,69.6 64.86,69.6 71.87,62.58 71.87,57.76 v1(72.13,57.5) ; H8_TP1.5 v1(66.79,49.88)
FSMC_A3: length 91.2
  Top Layer w0.254: v1(40.45,43.53) 39.18,43.53 v1(38.42,42.77) ; v1(36.89,31.34) 36.89,31.85 37.91,32.87 v1(37.91,40.99) ; H8_TP1.7 71.87,52.42 71.87,54.2 72.63,54.96 73.65,54.96 74.41,55.73 74.41,59.28 69.59,64.11 57.9,64.11 v1(55.62,66.39) ; v1(46.04,49.12) 45.78,49.38 45.78,64.36 v1(43.75,66.39) 42.32,67.82 U3.13 ; v1(36.87,29.8) U6.96
  Bottom Layer w0.254: v1(37.91,40.99) 38.93,42.01 38.93,42.26 v1(38.42,42.77) ; v1(46.04,49.12) v1(40.45,43.53) ; v1(36.89,31.34) 36.89,29.82 v1(36.87,29.8) ; v1(43.75,66.39) 44.01,66.65 44.19,66.65 44.44,66.39 v1(55.62,66.39)
FSMC_A4: length 102.8
  Top Layer w0.254: U6.97 36.37,27.58 38.78,25.17 40.56,25.17 v1(42.34,26.95) ; v1(41.9,70.46) 41.9,69.17 U3.14
  Bottom Layer w0.254: v1(41.9,70.46) 43.17,69.19 57.9,69.19 60.7,71.98 65.01,71.98 74.41,62.58 74.41,50.65 73.65,49.88 71.87,49.88 H8_TP1.9 70.6,47.85 64.76,42.01 64,42.01 62.98,40.99 62.98,40.23 62.22,39.47 56.12,39.47 45.71,29.06 44.44,29.06 v1(42.34,26.95)
FSMC_A5: length 101.8
  Top Layer w0.254: v1(57.14,68.43) 60.19,68.43 61.46,67.16 67.3,67.16 74.92,59.54 74.92,50.9 73.9,49.88 72.63,49.88 71.87,49.12 71.87,47.34 H8_TP1.11 ; U3.15 41.32,67.82 v1(41.48,67.66) ; v1(42.22,25.94) 41.97,25.94 40.7,24.67 38.67,24.67 35.87,27.46 U6.98
  Bottom Layer w0.254: v1(41.48,67.66) 42.5,68.68 56.89,68.68 v1(57.14,68.43) ; H8_TP1.11 70.6,45.31 64.76,39.47 64,39.47 62.98,38.45 62.98,37.69 62.22,36.93 54.35,36.93 45.96,28.55 44.84,28.55 v1(42.22,25.94)
FSMC_A6: length 89.3
  Top Layer w0.254: v1(32.68,40.41) 28.62,40.41 v1(27.76,41.28) ; v1(54.27,29.24) 54.02,29.24 v1(47.16,36.1) ; v1(27.25,56.52) 26.49,57.28 26.49,59.56 27.47,60.54 28.77,60.54 ; v1(35.37,29.9) U6.99
  Bottom Layer w0.254: 38.53,33.05 37.51,33.05 32.43,38.13 32.43,40.16 v1(32.68,40.41) ; 38.53,33.05 40.05,34.57 42.84,34.57 46.15,37.87 46.65,37.87 47.16,37.37 v1(47.16,36.1) ; 38.53,33.05 37.51,32.03 36.75,32.03 35.37,30.66 v1(35.37,29.9) ; H8_TP1.13 65.52,38.45 65.52,37.69 64.76,36.93 64,36.93 62.98,35.91 62.98,35.15 57.07,29.24 v1(54.27,29.24) ; v1(27.76,41.28) 27.76,54.23 26.74,55.25 26.74,56.01 v1(27.25,56.52)
FSMC_A7: length 88.4
  Top Layer w0.254: v1(29.96,46.07) 29.96,48.11 31.23,49.38 32.76,49.38 33.26,49.88 33.26,51.66 35.04,53.44 35.04,56.49 32.5,59.03 28.79,59.03 28.77,59.04 ; v1(41.65,24.74) 41.14,24.23 38.34,24.23 35.3,27.28 35.04,27.28 ; 35.04,27.28 v1(34.79,27.28) ; 35.04,27.28 34.87,27.45 U6.100 ; v1(52.06,23.98) 52.06,24.48 v1(55.36,27.79)
  Bottom Layer w0.254: v1(52.06,23.98) 51.81,23.72 42.66,23.72 v1(41.65,24.74) ; v1(29.96,46.07) 29.96,32.1 v1(34.79,27.28) ; H8_TP1.15 65.52,35.91 65.52,35.15 59.43,29.06 57.65,29.06 56.38,27.79 v1(55.36,27.79)
FSMC_A8: length 82
  Top Layer w0.254: v1(54.85,26.44) 56.12,27.71 v1(57.14,27.71) ; v1(33.12,32.54) 33.37,32.29 U6.103 33.37,27.6 34.53,26.44 35.55,26.44 38.34,23.65 41.39,23.65 42.41,24.67 42.41,25.17 v1(43.17,25.94) ; v1(32.61,35.33) 30.58,35.33 v1(28.55,37.37) ; v1(27.28,58.45) 27.37,58.54 28.77,58.54
  Bottom Layer w0.254: v1(43.17,25.94) 44.95,25.94 45.46,26.44 v1(54.85,26.44) ; v1(57.14,27.71) 57.39,27.46 59.61,27.46 H8_TP1.17 ; v1(27.28,58.45) 28.8,56.92 28.8,37.62 v1(28.55,37.37) ; v1(33.12,32.54) 33.37,32.79 33.37,34.57 v1(32.61,35.33)
FSMC_A9: length 80.9
  Top Layer w0.254: v1(27.18,57.47) 27.76,58.04 28.77,58.04 ; 32.87,27.21 U6.104 ; 32.87,27.21 v1(32.62,26.95) ; 32.87,27.21 35.67,24.41 v1(36.68,24.41)
  Bottom Layer w0.254: v1(27.18,57.47) 26.17,56.45 26.17,54.99 27.1,54.06 27.1,32.47 v1(32.62,26.95) ; H8_TP1.19 60.37,25.68 45.46,25.68 44.95,25.17 42.15,25.17 41.9,25.43 37.7,25.43 v1(36.68,24.41)
FSMC_A10: length 74.3
  Top Layer w0.254: v1(32.57,50.16) 32.57,51.69 34.6,53.72 34.6,56.26 32.83,58.04 30.29,58.04 ; U6.105 32.37,30.66 v1(32.63,30.92) ; v1(56.51,61.09) 58.04,59.56 58.55,59.56 59.56,58.55 61.85,58.55 ; v1(30.29,58.29) 30.29,58.04 ; 30.29,58.04 29.79,57.54 28.77,57.54 ; v1(36.45,60.07) 37.21,60.83 v1(37.21,61.85) ; v1(31.05,34.16) 32.32,34.16 v1(32.57,34.42)
  Bottom Layer w0.254: v1(56.51,61.09) 54.74,62.86 38.23,62.86 v1(37.21,61.85) ; v1(32.57,50.16) 32.57,45.59 31.3,44.32 31.3,34.42 v1(31.05,34.16) ; v1(32.57,34.42) 32.37,34.22 32.37,31.42 32.63,31.17 v1(32.63,30.92) ; v1(36.45,60.07) 35.43,59.05 31.05,59.05 v1(30.29,58.29)
FSMC_A11: length 65.1
  Top Layer w0.254: v1(31.88,31.11) 31.88,28.48 ; 28.77,57.04 32.87,57.04 v1(33.91,56.01) 33.91,53.72 v1(31.88,51.69)
  Bottom Layer w0.254: H9_TP2.3 60.32,57.53 40.26,57.53 37.97,55.24 37.72,55.24 36.7,56.26 34.16,56.26 v1(33.91,56.01) ; v1(31.88,31.11) 31.88,44.32 33.22,45.67 33.22,50.34 v1(31.88,51.69)
FSMC_A12: length 49.7
  Top Layer w0.254: v1(44.07,50.42) 39.75,50.42 37.82,48.49 U3.87 37.82,43.43 37.32,42.92 37.32,38.09 31.22,32 31.22,30.73 31.37,30.57 U6.107 ; v1(58.29,54.48) 59.31,54.48 60.32,53.47 H9_TP2.5
  Bottom Layer w0.254: v1(44.07,50.42) 44.32,50.42 47.37,53.47 49.15,53.47 50.16,54.48 v1(58.29,54.48)
FSMC_CLK: length 49.3
  Top Layer w0.254: v1(41.71,33.85) 41.45,34.1 41.45,36.13 v1(43.48,38.17) ; v1(54.66,51.12) 54.54,51 54.15,51 53.97,51.18 ; 50.6,53.54 50.67,53.47 51.94,53.47 ; 50.6,53.54 51.87,53.54 51.94,53.47 ; 50.6,53.54 U3.117 ; 52.45,52.96 52.45,52.7 52.63,52.53 ; 52.45,52.96 52.63,52.78 52.63,52.53 ; 52.45,52.96 51.94,53.47 ; 53.97,51.18 59.82,51.18 61.34,49.66 63.12,49.66 H9_TP2.10 ; 53.97,51.18 52.63,52.53 ; U6.92 38.87,30.33 v1(38.66,30.55)
  Bottom Layer w0.254: v1(38.66,30.55) 41.71,33.59 v1(41.71,33.85) ; v1(43.48,38.17) 44.25,38.93 45.52,38.93 54.66,48.07 v1(54.66,51.12)
FSMC_D0: length 74.7
  Top Layer w0.254: v1(44.19,33.12) 44.19,38.96 v1(42.41,40.74) ; H8_TP1.2 71.87,60.04 67.3,60.04 v1(66.79,59.54) ; v1(37.84,55.98) 36.82,54.96 36.82,47.6 ; v1(46.47,35.41) 47.37,34.5 U6.75 ; 36.82,47.6 U3.85 ; 36.82,47.6 36.82,46.33 v1(37.07,46.07)
  Bottom Layer w0.254: v1(44.19,33.12) v1(46.47,35.41) ; v1(37.84,55.98) 39.87,58.01 59.17,58.01 60.95,59.79 66.54,59.79 v1(66.79,59.54) ; v1(37.07,46.07) v1(42.41,40.74)
FSMC_D1: length 103.8
  Top Layer w0.254: U3.86 37.32,50.29 v1(40.99,53.95) ; v1(68.57,50.65) 68.57,46.33 70.09,44.8 73.65,44.8 74.41,44.04 74.41,40.49 73.65,39.72 72.63,39.72 71.87,38.96 71.87,37.95 v1(71.11,37.18) ; v1(54.35,27.79) 53.84,27.28 47.06,27.28 46.87,27.46 U6.76 ; v1(45.05,59.28) 45.05,58.01 v1(42.26,55.22)
  Bottom Layer w0.254: v1(45.05,59.28) 45.81,60.04 49.37,60.04 49.88,59.54 57.39,59.54 58.16,60.3 67.3,60.3 68.57,59.03 68.57,58.27 69.33,57.5 71.11,57.5 72.13,56.49 72.13,56.23 ; 72.13,56.23 71.87,55.98 71.87,53.19 71.11,52.42 70.09,52.42 68.57,50.9 v1(68.57,50.65) ; 72.13,56.23 H8_TP1.4 ; v1(54.35,27.79) 55.11,27.02 59.93,27.02 70.09,37.18 v1(71.11,37.18) ; v1(42.26,55.22) v1(40.99,53.95)
FSMC_D2: length 69
  Top Layer w0.254: v1(49.27,34.92) 48.25,35.94 v1(48.25,37.46) ; v1(46.73,32.38) 46.37,32.03 U6.77 ; 65.37,47.12 61.2,47.12 58.41,49.91 56.89,49.91 56.38,49.4 56.38,48.64 56.89,48.13 v1(56.89,46.35) ; 65.37,47.12 v1(65.52,46.96) ; 65.37,47.12 65.27,47.22 61.2,47.22 58.41,50.01 v1(52.31,50.01) ; v1(49.01,52.04) U3.114
  Bottom Layer w0.254: v1(48.25,37.46) 56.89,46.1 v1(56.89,46.35) ; v1(49.27,34.92) v1(46.73,32.38) ; v1(49.01,52.04) 51.55,52.04 52.57,51.03 52.57,50.26 v1(52.31,50.01) ; v1(65.52,46.96) 68.57,50.01 71.11,50.01 71.87,50.77 71.87,52.42 H8_TP1.6
FSMC_D3: length 58.9
  Top Layer w0.254: v1(69.08,54.96) 69.08,51.05 70.24,49.88 71.87,49.88 H8_TP1.8 ; U3.115 51.67,52.54 v1(51.81,52.68) ; v1(45.96,40.23) 45.71,39.98 45.71,29.56 45.87,29.4 U6.78 ; v1(56.63,53.69) v1(55.62,52.68) ; v1(67.81,55.22) 65.78,57.25 63.74,57.25 v1(63.49,57)
  Bottom Layer w0.254: v1(63.49,57) 62.98,56.49 62.98,55.47 62.22,54.71 59.93,54.71 58.92,53.69 v1(56.63,53.69) ; v1(45.96,40.23) 46.22,40.23 53.08,47.09 53.08,52.17 52.57,52.68 ; 52.57,52.68 v1(55.62,52.68) ; 52.57,52.68 v1(51.81,52.68) ; v1(69.08,54.96) 68.06,54.96 v1(67.81,55.22)
FSMC_D4: length 110.5
  Top Layer w0.254: v1(30.72,27.02) 35.04,22.71 41.9,22.71 42.92,23.72 45.46,23.72 46.22,24.48 v1(46.22,24.99) 44.95,26.26 44.95,27.02 44.37,27.6 U6.81 ; v1(32.76,53.69) 29.91,56.54 28.77,56.54 ; v1(26.41,38.96) v1(33.26,38.96) ; v1(33.77,44.8) 34.28,44.3 v1(34.28,43.28) ; v1(34.53,49.88) v1(34.53,51.92)
  Bottom Layer w0.254: v1(26.41,38.96) 26.41,31.34 v1(30.72,27.02) ; v1(34.53,49.88) 34.79,49.63 34.79,45.82 v1(33.77,44.8) ; v1(46.22,24.99) 46.47,25.25 61.71,25.25 71.87,35.41 71.87,38.96 72.63,39.72 73.65,39.72 74.41,40.49 74.41,47.34 H8_TP1.10 ; v1(34.53,51.92) v1(32.76,53.69) ; v1(33.26,38.96) 33.77,39.47 33.77,42.77 v1(34.28,43.28)
FSMC_D5: length 77.6
  Top Layer w0.254: v1(52.82,34.38) 52.88,34.32 64.76,34.32 65.52,35.08 v1(65.52,36.86) ; v1(44.58,30.31) 43.87,29.61 ; 43.87,29.61 U6.82 ; 43.87,29.61 43.87,31.52 42.86,32.54 v1(42.86,36.6) ; H8_TP1.12 72.71,46.07 v1(72.13,45.49) ; v1(50.17,35.14) 51.44,33.87 v1(51.44,32.85) ; v1(41.59,40.41) 41.84,40.16 v1(41.84,37.62) ; 28.77,56.04 29.79,56.04 31.94,53.9 v1(31.94,52.61) ; v1(35.24,44.48) 35.24,44.73 v1(33.97,46)
  Bottom Layer w0.254: v1(42.86,36.6) v1(41.84,37.62) ; v1(44.58,30.31) 45.59,30.31 50.17,34.88 v1(50.17,35.14) ; v1(35.24,44.48) 37.78,44.48 41.59,40.67 v1(41.59,40.41) ; v1(65.52,36.86) 66.03,37.37 66.03,38.13 70.09,42.19 71.11,42.19 71.87,42.95 71.87,45.24 v1(72.13,45.49) ; v1(51.44,32.85) 52.82,34.24 v1(52.82,34.38) ; v1(33.97,46) 33.71,46.26 33.71,50.83 v1(31.94,52.61)
FSMC_D6: length 94.2
  Top Layer w0.254: H8_TP1.14 71.87,42.26 71.87,40.49 71.11,39.72 70.09,39.72 69.08,38.71 v1(69.08,31.6) ; v1(31.69,27.02) 35.5,23.21 41.6,23.21 43.37,24.99 43.37,25.25 ; v1(30.17,28.55) 30.17,34.9 v1(28.64,36.42) ; 43.37,25.25 44.39,26.26 44.39,26.77 43.88,27.28 43.63,27.28 43.37,27.53 U6.83 ; 43.37,25.25 44.57,25.25 v1(45.33,24.48) ; v1(27.37,55.66) 27.49,55.54 28.77,55.54
  Bottom Layer w0.254: v1(27.37,55.66) 28.39,54.65 28.39,38.2 27.88,37.69 27.88,37.18 v1(28.64,36.42) ; v1(45.33,24.48) 45.59,24.23 46.35,24.23 46.86,24.74 62.22,24.74 v1(69.08,31.6) ; v1(31.69,27.02) v1(30.17,28.55)
FSMC_D7: length 76.7
  Top Layer w0.254: 28.77,54.04 29.79,54.04 30.94,52.9 v1(30.94,50.83) ; v1(42.11,35.84) 42.37,35.59 42.37,32.29 42.87,31.78 U6.84 42.87,27.21 43.5,26.58 v1(43.75,26.58) ; v1(35.76,37.62) v1(30.68,37.62) ; v1(57.9,28.29) 57.72,28.48 v1(49.09,28.48)
  Bottom Layer w0.254: v1(30.68,37.62) 30.68,44.73 31.44,45.49 31.44,50.32 v1(30.94,50.83) ; v1(43.75,26.58) 44.24,27.07 47.68,27.07 v1(49.09,28.48) ; v1(42.11,35.84) 40.33,37.62 v1(35.76,37.62) ; v1(57.9,28.29) 59.43,28.29 66.03,34.9 66.03,35.66 70.09,39.72 71.87,39.72 H8_TP1.16
FSMC_NE1: length 99.2
  Top Layer w0.254: v1(40.87,5.05) 40.36,5.05 39.85,5.56 39.85,6.55 U6.19 ; 62.87,42.04 63.12,41.78 63.12,40.26 63.88,39.5 64.9,39.5 66.17,38.23 66.17,34.92 58.04,26.8 58.04,13.33 51.44,6.73 49.4,6.73 v1(49.25,6.58) ; 62.87,42.04 64.9,42.04 65.66,42.8 65.66,44.58 H9_TP2.12 ; 62.87,42.04 61.09,42.04 v1(60.83,42.29) ; v1(56.01,40.77) 54.99,40.77 v1(52.7,43.05) ; U3.123 51.73,56.54 v1(51.94,56.33) ; v1(55.75,55.75) 55.75,55.5 57.28,53.97 57.28,53.21 v1(56.01,51.94)
  Bottom Layer w0.254: v1(60.83,42.29) 57.53,42.29 v1(56.01,40.77) ; v1(51.94,56.33) 52.52,55.75 v1(55.75,55.75) ; v1(56.01,51.94) 57.78,50.16 57.78,48.89 57.02,48.13 55.75,48.13 51.94,44.32 51.94,43.81 v1(52.7,43.05) ; v1(40.87,5.05) 42.39,6.58 v1(49.25,6.58)
FSMC_NE2: length 78.9
  Top Layer w0.254: v1(57.02,49.15) 57.02,48.89 60.58,45.34 ; v1(47.62,18.92) 40.37,11.67 U6.20 ; 60.58,45.34 60.32,45.34 v1(59.31,44.32) ; 60.58,45.34 61.34,44.58 63.12,44.58 H9_TP2.14 ; v1(50.42,35.94) 57.28,29.08 58.04,29.08 58.55,28.57 58.55,28.07 55.25,24.76 53.72,24.76 v1(52.96,24) ; U3.124 50.39,57.02 54.48,57.02 54.99,56.51 v1(54.99,51.94)
  Bottom Layer w0.254: v1(59.31,44.32) 58.55,44.32 50.42,36.19 v1(50.42,35.94) ; v1(47.62,18.92) 48.89,20.19 49.15,20.19 v1(52.96,24) ; v1(54.99,51.94) 57.02,49.91 v1(57.02,49.15)
FSMC_NE3: length 90.8
  Top Layer w0.254: v1(48.89,58.8) 48.89,58.04 49.4,57.53 50.36,57.53 U3.125 ; v1(42.39,8.1) 41.37,8.1 40.87,7.59 U6.21 ; v1(58.29,58.8) 59.82,57.28 62.36,57.28 63.12,56.51 63.12,55.5 63.88,54.74 64.9,54.74 66.17,53.47 66.17,42.54 H9_TP2.16 66.67,38.48 66.67,34.67 58.55,26.54 58.55,13.08 51.53,6.07 v1(51.28,6.07)
  Bottom Layer w0.254: v1(58.29,58.8) 58.04,58.55 49.15,58.55 v1(48.89,58.8) ; v1(51.28,6.07) 49.25,8.1 v1(42.39,8.1)
FSMC_NE4: length 104.4
  Top Layer w0.254: U6.22 41.37,5.36 42.04,4.7 55.75,4.7 66.42,15.37 66.42,20.45 65.41,21.46 v1(64.9,21.46) ; v1(56.26,60.32) 57.02,59.56 v1(57.02,56.77) ; U3.127 51.44,58.54 52.45,57.53 54.99,57.53 v1(55.75,56.77) ; v1(57.78,60.83) 63.88,60.83 68.45,56.26 68.45,54.99 67.94,54.48 67.94,42.29 v1(68.2,42.04) ; v1(66.17,40) 66.17,39.75 67.94,37.97 67.94,28.07 68.45,27.56 68.45,25.78 v1(67.44,24.76)
  Bottom Layer w0.254: v1(67.44,24.76) 67.44,24 v1(64.9,21.46) ; v1(57.02,56.77) v1(55.75,56.77) ; v1(56.26,60.32) 57.28,60.32 v1(57.78,60.83) ; H9_TP2.18 v1(66.17,40) v1(68.2,42.04)
FSMC_NOE: length 52.1
  Top Layer w0.254: H9_TP2.8 63.12,52.2 60.32,52.2 v1(59.31,53.21) ; v1(46.35,36.26) 47.12,37.02 47.12,38.29 v1(52.7,43.88) ; U3.118 52.2,54.04 v1(52.45,53.79) ; U6.86 41.87,30.51 v1(41.62,30.77)
  Bottom Layer w0.254: v1(41.62,30.77) 41.62,31.53 v1(46.35,36.26) ; 53.21,54.04 52.7,54.04 v1(52.45,53.79) ; 53.21,54.04 55.25,54.04 56.33,52.96 ; 53.21,54.04 53.21,54.01 53.25,53.97 55.25,53.97 56.26,52.96 56.33,52.96 ; 56.33,52.96 58.29,50.99 58.29,48.71 57.28,47.69 56.51,47.69 v1(52.7,43.88) ; 56.33,52.96 59.06,52.96 v1(59.31,53.21)
FSMC_NWE: length 91.2
  Top Layer w0.254: v1(57.53,55.24) 59.31,55.24 59.82,54.74 63.12,54.74 H9_TP2.6 ; U3.119 50.31,54.48 v1(49.04,54.48) ; U6.23 41.87,5.62 42.29,5.21 51.44,5.21 59.06,12.83 59.06,23.24 60.32,24.51 65.91,24.51 66.42,25.02 66.42,28.07 v1(67.18,28.83) ; v1(66.42,54.23) 67.44,53.21 67.44,39.24 68.45,38.23 68.45,30.61 v1(68.71,30.35)
  Bottom Layer w0.254: H9_TP2.6 65.66,53.47 v1(66.42,54.23) ; v1(49.04,54.48) 49.55,54.99 57.28,54.99 v1(57.53,55.24) ; v1(68.71,30.35) v1(67.18,28.83)
JTCK: length 67
  Top Layer w0.254: v1(58.29,43.05) 54.99,46.35 52.29,46.35 50.51,48.13 ; v1(23.84,43.05) 27.15,39.75 35.02,39.75 v1(35.27,40) ; v1(48.74,46.1) 50.51,47.88 50.51,48.13 ; 50.51,48.13 50.51,49.4 U3.109 ; v1(7.87,45.97) R18.2
  Bottom Layer w0.254: v1(7.87,45.97) 9.14,45.97 10.29,44.83 22.07,44.83 v1(23.84,43.05) ; v1(35.27,40) 35.53,39.75 42.39,39.75 v1(48.74,46.1) ; H9_TP2.13 58.55,43.31 v1(58.29,43.05)
JTDI: length 69.1
  Top Layer w0.254: 52.2,51.18 52.2,50.85 51.39,50.04 U3.110 ; 52.2,51.18 v1(51.82,50.8) ; 52.2,51.18 52.45,51.18 53.21,50.42 59.82,50.42 H9_TP2.9 ; v1(30.23,49.28) 29.97,49.02 27.18,49.02 v1(25.65,50.55) ; v1(47.5,51.82) 46.48,52.83 v1(46.48,53.59) ; v1(7.87,51.05) 4.94,51.05
  Bottom Layer w0.254: v1(46.48,53.59) 43.94,51.05 34.54,51.05 32.26,53.34 31.75,53.34 30.23,51.82 v1(30.23,49.28) ; v1(7.87,51.05) 9.14,51.05 10.41,49.78 24.89,49.78 v1(25.65,50.55) ; v1(47.5,51.82) 48.51,50.8 v1(51.82,50.8)
JTDO: length 95.4
  Top Layer w0.254: U3.133 49.35,61.54 47.37,59.56 47.37,54.74 47.88,54.23 ; 47.88,54.23 v1(47.37,54.23) ; 47.88,54.23 47.88,52.96 v1(47.62,52.7) ; v1(8,42.8) 6.83,42.8 R19.2 ; v1(32.64,54.74) v1(31.62,55.75) ; v1(52.45,49.15) 52.7,49.4 54.99,49.4 56.01,48.39 56.01,46.25 61.49,40.77 H9_TP2.15
  Bottom Layer w0.254: v1(32.64,54.74) 34.16,53.21 41.28,53.21 42.29,54.23 v1(47.37,54.23) ; 9.14,40.89 8,42.04 v1(8,42.8) 8,43.56 7.24,44.32 7.24,51.43 8,52.2 20.19,52.2 27.05,59.05 28.32,59.05 v1(31.62,55.75) ; v1(52.45,49.15) 49.15,49.15 46.86,51.43 46.86,52.2 47.37,52.7 v1(47.62,52.7)
JTMS: length 70.3
  Top Layer w0.254: v1(54.99,45.34) 54.48,45.85 49.4,45.85 48.89,45.34 47.62,45.34 46.82,46.14 U3.105 v1(46.82,49.27) ; v1(58.8,48.13) 61.09,45.85 H9_TP2.11 ; v1(24.47,43.68) 25.23,42.92 27.01,42.92 28.54,41.4 v1(32.6,41.4) ; v1(7.87,48.51) R4.2
  Bottom Layer w0.254: v1(32.6,41.4) 32.6,42.67 39.71,49.78 46.32,49.78 v1(46.82,49.27) ; v1(7.87,48.51) 9.14,48.51 10.42,47.24 20.92,47.24 v1(24.47,43.68) ; v1(58.8,48.13) 57.78,47.12 56.77,47.12 v1(54.99,45.34)
LED1: length 22.6
  Top Layer w0.254: 63.01,26.88 64.75,25.15 v1(65.55,25.15) ; U6.54 51.59,17.28 53.88,19.56 53.88,20.58 v1(53.62,20.83)
  Bottom Layer w0.254: v1(53.62,20.83) 61.23,20.83 v1(65.55,25.15)
LED2: length 17.4
  Top Layer w0.254: v1(61.93,23.29) 63.01,23.29 ; U6.55 v1(49.3,17.78)
  Bottom Layer w0.254: v1(49.3,17.78) 51.84,20.32 51.84,20.57 54.56,23.29 v1(61.93,23.29)
LED3: length 14.4
  Top Layer w0.254: U6.56 51.84,18.28 52.61,19.04 v1(52.61,19.29) ; v1(59.72,19.55) 59.72,20.23 60.26,20.78 62,20.78 63.01,19.76
  Bottom Layer w0.254: v1(59.72,19.55) 59.46,19.29 v1(52.61,19.29)
LED4: length 19.2
  Top Layer w0.254: v1(49.05,18.52) 49.3,18.78 U6.57 ; 63.01,16.11 62,17.13 60.1,17.13 59.84,16.87 v1(59.84,16.11)
  Bottom Layer w0.254: v1(49.05,18.52) 48.54,18.01 48.54,17.51 49.94,16.11 v1(59.84,16.11)
LED5: length 28.5
  Top Layer w0.254: U6.58 v1(51.84,19.28) ; LED5.1 71.4,26.13 v1(71.4,25.88)
  Bottom Layer w0.254: v1(71.4,25.88) 71.66,25.63 71.66,21.82 68.35,18.51 52.1,18.51 51.84,18.77 v1(51.84,19.28)
LED6: length 28.4
  Top Layer w0.254: v1(49.05,19.52) 49.3,19.78 U6.59 ; LED6.1 71.14,24.3 v1(68.82,24.3)
  Bottom Layer w0.254: v1(49.05,19.52) 49.3,19.52 54.08,24.3 63.74,24.3 65.26,25.83 67.29,25.83 v1(68.82,24.3)
LED7: length 23
  Top Layer w0.254: v1(68.61,19.77) 68.61,20.02 69.37,20.78 71.13,20.78 LED7.1 ; v1(52.35,20.02) 52.1,20.28 U6.60
  Bottom Layer w0.254: v1(68.61,19.77) 68.1,20.28 59.46,20.28 59.21,20.02 v1(52.35,20.02)
LED8: length 31.3
  Top Layer w0.254: v1(68.51,16.36) 69.28,17.13 71.14,17.13 LED8.1 ; U6.61 49.3,20.78 48.29,19.76 48.29,16.71 v1(48.54,16.46)
  Bottom Layer w0.254: v1(48.54,16.46) 49.56,15.44 67.59,15.44 v1(68.51,16.36)
MCO: length 63.9
  Top Layer w0.254: 56.64,40.77 61.72,35.69 H9_TP2.19 ; 56.64,40.77 56.64,40.51 54.86,38.73 49.12,38.73 v1(48.86,38.99) ; 56.64,40.77 56.64,41.02 53.18,44.47 48.61,44.47 48.26,44.83 45.97,44.83 44.32,46.48 U3.100 ; U6.127 29.69,17.28 v1(30.07,17.65) ; v1(46.32,37.21) 46.32,38.48 v1(46.83,38.99)
  Bottom Layer w0.254: v1(30.07,17.65) 30.07,20.95 v1(46.32,37.21) ; v1(48.86,38.99) v1(46.83,38.99)
MCO2: length 65.1
  Top Layer w0.254: H9_TP2.20 63.12,36.96 61.34,36.96 53.21,45.08 v1(50.16,45.08) ; v1(40,38.99) 39.5,38.48 v1(39.5,33.15) ; U3.99 43.81,46.35 46.1,44.07 v1(47.62,44.07) ; v1(30.1,16.78) U6.128
  Bottom Layer w0.254: v1(30.1,16.78) 29.34,17.54 29.34,20.95 37.47,29.08 37.47,31.11 v1(39.5,33.15) ; v1(40,38.99) 42.54,38.99 v1(47.62,44.07) 48.64,45.08 v1(50.16,45.08)
NJTRST: length 72.9
  Top Layer w0.254: v1(55.65,60.83) 55.65,59.05 56.41,58.29 56.41,55.5 57.93,53.97 57.93,53.72 60.73,50.93 H9_TP2.7 ; v1(52.15,62.04) U3.134 ; v1(7.87,53.59) R2.2
  Bottom Layer w0.254: v1(52.15,62.04) 54.44,62.04 54.63,61.85 ; 54.63,61.85 v1(55.65,60.83) ; 54.63,61.85 53.87,61.09 36.6,61.09 35.07,59.56 26.95,59.56 21.1,53.72 13.23,53.72 12.21,54.74 10.29,54.74 9.14,53.59 v1(7.87,53.59)
STM_RESET: length 84.4
  Top Layer w0.254: 9.14,38.35 9.99,38.35 11.26,39.62 19.06,39.62 C7.1 21.37,38.32 ; v1(58.29,38.23) v1(47.88,38.23) ; 21.37,38.32 22.39,39.33 22.39,41.7 R5.1 13,51.09 v1(13,55.15) ; 21.37,38.32 v1(36.61,38.32)
  Bottom Layer w0.254: v1(36.61,38.32) 42.46,38.32 43.22,37.55 43.73,37.55 44.49,38.32 47.79,38.32 v1(47.88,38.23) ; H9_TP2.17 v1(58.29,38.23) ; U18.1 13,58.57 v1(13,55.15)
U2_RX: length 70.2
  Top Layer w0.254: v1(54.99,67.06) 60.58,67.06 H8_TP0.5 ; 28.77,67.04 29.29,67.56 v1(29.34,67.56) ; v1(28.07,94.23) 28.57,94.23 29.34,95 29.34,95.25 28.19,96.39 U7.6
  Bottom Layer w0.254: v1(28.07,94.23) 28.07,73.91 32.13,69.85 34.92,69.85 36.96,67.82 36.96,67.06 ; 36.96,67.06 29.84,67.06 v1(29.34,67.56) ; 36.96,67.06 v1(54.99,67.06)
U2_TX: length 73.1
  Top Layer w0.254: v1(62.61,73.15) 63.63,72.14 64.9,72.14 65.66,71.37 65.66,70.36 64.9,69.6 63.88,69.6 62.61,68.33 H8_TP0.3 ; v1(29.08,97.03) 28.59,97.03 U7.7 ; v1(32.38,70.61) 31.37,70.61 30.86,70.1 30.86,69.13 U3.36
  Bottom Layer w0.254: v1(62.61,73.15) 45.34,73.15 43.05,70.87 42.54,70.87 42.29,71.12 40.26,71.12 39.5,70.36 32.64,70.36 v1(32.38,70.61) 32.38,93.73 v1(29.08,97.03)
$1N9899: length 9
  Top Layer w0.254: v1(30.84,50.04) 28.78,50.04 ; C3.2 v1(30.84,45.97)
  Bottom Layer w0.254: v1(30.84,45.97) v1(30.84,50.04)
$1N9927: length 8.7
  Top Layer w0.254: v1(51.96,47.75) 52.21,47.5 C4.2 ; v1(47.52,49.72) 47.52,48.7 47.26,48.45 47.26,47.56 U3.106
  Bottom Layer w0.254: v1(47.52,49.72) 49.48,47.75 v1(51.96,47.75)
$1N10441: length 12.3
  Top Layer w0.254: C16.1 37.48,77.83 H12.3 38.1,73.39 R20.1 36.82,72.11 U3.24
$1N10459: length 25.5
  Top Layer w0.254: v1(49.64,67.69) 49.39,67.69 49.01,67.32 49.01,64.39 49.36,64.04 U3.138 ; v1(52.69,67.94) 52.94,68.2 54.21,68.2 58.02,72.01 58.02,72.77 R1.1 54.48,76.34 H9.2
  Bottom Layer w0.254: v1(49.64,67.69) 49.89,67.94 v1(52.69,67.94)
$1N11231: length 31.7
  Top Layer w0.254: U3.25 36.32,67.82 v1(36.22,67.71)
  Bottom Layer w0.254: U18.4 15.64,70.87 15.64,72.9 16.4,73.66 17.67,73.66 23.12,68.22 35.71,68.22 v1(36.22,67.71)
$1N13880: length 9.2
  Top Layer w0.254: U7.2 16.64,97.66 H11.2
$1N13884: length 14.2
  Top Layer w0.254: H11.3 13.19,98.57 13.19,100.46 13.95,101.22 20.3,101.22 U7.1
$1N21011: length 5.3
  Top Layer w0.254: LED4.2 61.93,15.09 64.4,15.09 R9.1
$1N21018: length 5.3
  Top Layer w0.254: R8.1 64.4,18.75 61.93,18.75 LED3.2
$1N21026: length 5.3
  Top Layer w0.254: LED2.2 61.93,22.27 63.71,22.27 64.72,23.29 R7.1
$1N21031: length 5.3
  Top Layer w0.254: LED1.2 61.93,27.9 64.4,27.9 R6.1
$1N21156: length 5.3
  Top Layer w0.254: LED5.2 71.07,27.9 73.55,27.9 R10.1
$1N21160: length 5.3
  Top Layer w0.254: R11.1 73.55,22.27 71.07,22.27 LED6.2
$1N21165: length 5.3
  Top Layer w0.254: LED7.2 71.07,18.75 73.55,18.75 R12.1
$1N21170: length 5.3
  Top Layer w0.254: LED8.2 71.07,15.09 73.55,15.09 R13.1
$1N33872: length 14.3
  Top Layer w0.254: U3.23 37.32,70.61 R20.2 43.18,76.47 H12.1 43.93,77.96 C17.1
$1N35655: length 5.1
  Top Layer w0.254: U7.8 C12.1

## Copper pours and planes (outline as drawn; the poured copper is in the pictures)
GND on Bottom Layer: 1.02,101.09 77.6,101.09 77.6,2.03 1.02,2.03

## Text on the board
Bottom Silkscreen Layer: FSMC_A0 | FSMC_A1 | FSMC_A2 | FSMC_A3 | FSMC_A4 | FSMC_A5 | FSMC_A6 | FSMC_A7 | FSMC_A8 | FSMC_A9 | FSMC_D0 | FSMC_D1 | FSMC_D2 | FSMC_D3 | FSMC_D4 | FSMC_D5 | FSMC_D6 | FSMC_D7 | FSMC_TDO | FSMC_TDI
Top Silkscreen Layer: FPGA_TMS | FPGA_TCK | FPGA_NWE | FPGA_NOE | FPGA_CLK | FPGA_NE1 | FPGA_NE2 | FPGA_NE3 | FPGA_NE4 | MCO2 | STM_RESET | FSMC_A10 | FSMC_A12 | FSMC_A11 | NJTRST | U2_TX | U2_RX | JTMS | JTCK | JTDO | JTDI | MCO | 5V | 3.3V | ESP_TX | ESP_RX | D_IN | GND | F407 | XO2
